# Altium schematic sheet fpga-bank2-inside.SchDoc: FPGA - Bank 2
size Letter; CheckedBy: E. Chiu; CompanyName: Brinton Engineering, LLC; DrawnBy: J. Brinton; Engineer: J. Brinton; Address1: 3479 Edison Way; Address2: Menlo Park CA 94025; Address3: +1 (877) 778-8435; Address4: brintonengineering.com; Revision: 1; SheetNumber: 9; SheetTotal: 60
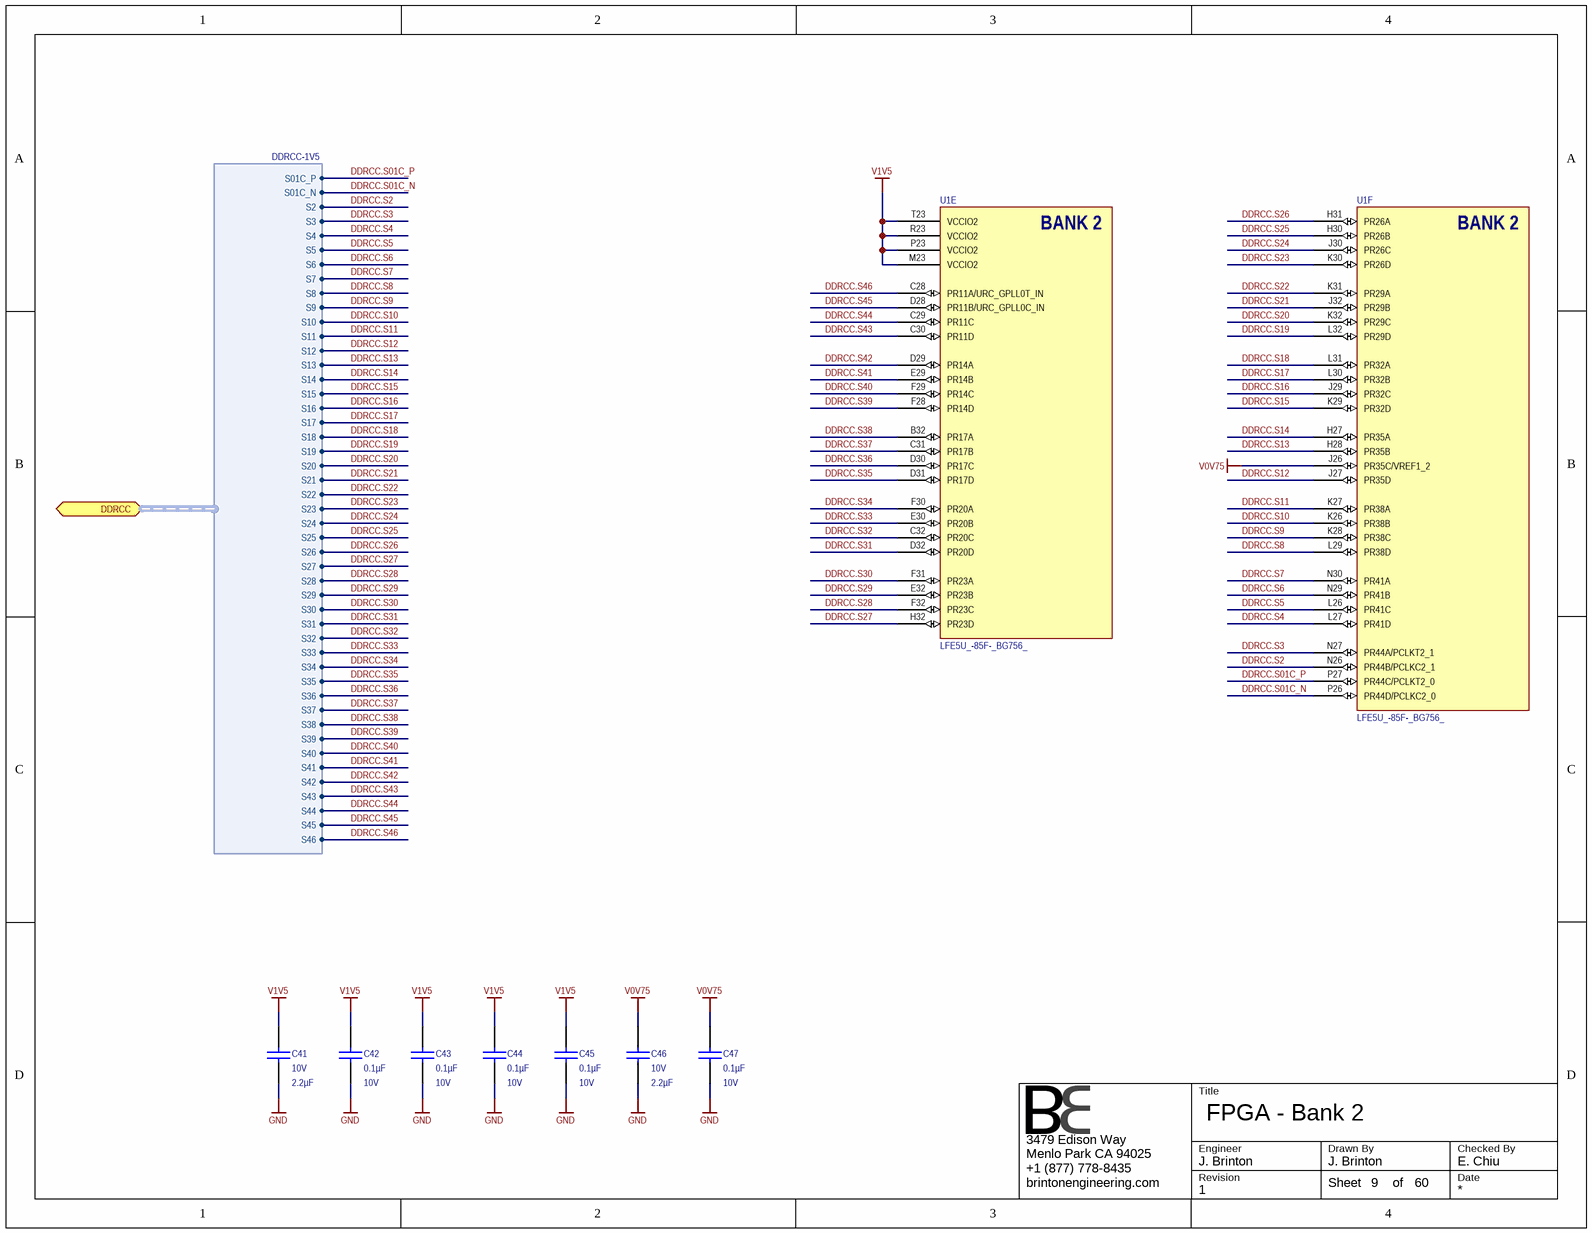
[diagram p0: fpga-bank2-inside.SchDoc]

## Parts
C41  Voltage - Rated: 10V  Capacitance: 2.2µF  [CAPC1608X90N]  (hidden comment: GRM188R71A225KE15D)
C42  Capacitance: 0.1µF  Voltage - Rated: 10V  [CAPC1005X56N]  (hidden comment: GRM155R71A104KA01J)
C43  Capacitance: 0.1µF  Voltage - Rated: 10V  [CAPC1005X56N]  (hidden comment: GRM155R71A104KA01J)
C44  Capacitance: 0.1µF  Voltage - Rated: 10V  [CAPC1005X56N]  (hidden comment: GRM155R71A104KA01J)
C45  Capacitance: 0.1µF  Voltage - Rated: 10V  [CAPC1005X56N]  (hidden comment: GRM155R71A104KA01J)
C46  Voltage - Rated: 10V  Capacitance: 2.2µF  [CAPC1608X90N]  (hidden comment: GRM188R71A225KE15D)
C47  Capacitance: 0.1µF  Voltage - Rated: 10V  [CAPC1005X56N]  (hidden comment: GRM155R71A104KA01J)
U1  LFE5U_-85F-_BG756_  [caBGA756]  (parts E,F of 19)

## Ports
DDRCC (harness DDRCC-1V5)

## Harnesses
DDRCC-1V5: S01C_P, S01C_N, S2, S3, S4, S5, S6, S7, S8, S9, S10, S11, S12, S13, S14, S15, S16, S17, S18, S19, S20, S21, S22, S23, S24, S25, S26, S27, S28, S29, S30, S31, S32, S33, S34, S35, S36, S37, S38, S39, S40, S41, S42, S43, S44, S45, S46

## Nets
GND: C41.1 C42.1 C43.1 C44.1 C45.1 C46.1 C47.1
V0V75: C46.2 C47.2 U1.J26(PR35C/VREF1_2)
V1V5: C41.2 C42.2 C43.2 C44.2 C45.2 U1.M23(VCCIO2) U1.P23(VCCIO2) U1.R23(VCCIO2) U1.T23(VCCIO2)
DDRCC.S01C_N: U1.P26(PR44D/PCLKC2_0) ; port DDRCC.S01C_N
DDRCC.S01C_P: U1.P27(PR44C/PCLKT2_0) ; port DDRCC.S01C_P
DDRCC.S2: U1.N26(PR44B/PCLKC2_1) ; port DDRCC.S2
DDRCC.S3: U1.N27(PR44A/PCLKT2_1) ; port DDRCC.S3
DDRCC.S4: U1.L27(PR41D) ; port DDRCC.S4
DDRCC.S5: U1.L26(PR41C) ; port DDRCC.S5
DDRCC.S6: U1.N29(PR41B) ; port DDRCC.S6
DDRCC.S7: U1.N30(PR41A) ; port DDRCC.S7
DDRCC.S8: U1.L29(PR38D) ; port DDRCC.S8
DDRCC.S9: U1.K28(PR38C) ; port DDRCC.S9
DDRCC.S10: U1.K26(PR38B) ; port DDRCC.S10
DDRCC.S11: U1.K27(PR38A) ; port DDRCC.S11
DDRCC.S12: U1.J27(PR35D) ; port DDRCC.S12
DDRCC.S13: U1.H28(PR35B) ; port DDRCC.S13
DDRCC.S14: U1.H27(PR35A) ; port DDRCC.S14
DDRCC.S15: U1.K29(PR32D) ; port DDRCC.S15
DDRCC.S16: U1.J29(PR32C) ; port DDRCC.S16
DDRCC.S17: U1.L30(PR32B) ; port DDRCC.S17
DDRCC.S18: U1.L31(PR32A) ; port DDRCC.S18
DDRCC.S19: U1.L32(PR29D) ; port DDRCC.S19
DDRCC.S20: U1.K32(PR29C) ; port DDRCC.S20
DDRCC.S21: U1.J32(PR29B) ; port DDRCC.S21
DDRCC.S22: U1.K31(PR29A) ; port DDRCC.S22
DDRCC.S23: U1.K30(PR26D) ; port DDRCC.S23
DDRCC.S24: U1.J30(PR26C) ; port DDRCC.S24
DDRCC.S25: U1.H30(PR26B) ; port DDRCC.S25
DDRCC.S26: U1.H31(PR26A) ; port DDRCC.S26
DDRCC.S27: U1.H32(PR23D) ; port DDRCC.S27
DDRCC.S28: U1.F32(PR23C) ; port DDRCC.S28
DDRCC.S29: U1.E32(PR23B) ; port DDRCC.S29
DDRCC.S30: U1.F31(PR23A) ; port DDRCC.S30
DDRCC.S31: U1.D32(PR20D) ; port DDRCC.S31
DDRCC.S32: U1.C32(PR20C) ; port DDRCC.S32
DDRCC.S33: U1.E30(PR20B) ; port DDRCC.S33
DDRCC.S34: U1.F30(PR20A) ; port DDRCC.S34
DDRCC.S35: U1.D31(PR17D) ; port DDRCC.S35
DDRCC.S36: U1.D30(PR17C) ; port DDRCC.S36
DDRCC.S37: U1.C31(PR17B) ; port DDRCC.S37
DDRCC.S38: U1.B32(PR17A) ; port DDRCC.S38
DDRCC.S39: U1.F28(PR14D) ; port DDRCC.S39
DDRCC.S40: U1.F29(PR14C) ; port DDRCC.S40
DDRCC.S41: U1.E29(PR14B) ; port DDRCC.S41
DDRCC.S42: U1.D29(PR14A) ; port DDRCC.S42
DDRCC.S43: U1.C30(PR11D) ; port DDRCC.S43
DDRCC.S44: U1.C29(PR11C) ; port DDRCC.S44
DDRCC.S45: U1.D28(PR11B/URC_GPLL0C_IN) ; port DDRCC.S45
DDRCC.S46: U1.C28(PR11A/URC_GPLL0T_IN) ; port DDRCC.S46

## Notes on the sheet
- Title
- Engineer
- Revision
- Drawn By
- Checked By
- Date
- Sheet
- of
- (in symbol LFE5U_-85F-_BG756_, part E) BANK 2
- (in symbol LFE5U_-85F-_BG756_, part F) BANK 2

## Library data of the parts
C41 C46 = GRM188R71A225KE15D: CAP CER 2.2UF 10V 10% X7R 0603; Manufacturer: Murata Electronics North America; Manufacturer P/N: GRM188R71A225KE15D; Operating Temperature: -55°C ~ 125°C; Thickness (Max): 0.035" (0.90mm); Tolerance: ±10%; Package / Case: 0603 (1608 Metric); Temperature Coefficient: X7R; Supplier 1: Newark; Supplier 2: Digi-Key; RoHS: RoHS Compliant; Size / Dimension: 0.063" L x 0.031" W (1.60mm x 0.80mm); Mounting Type: Surface Mount, MLCC; ComponentLink1URL: http://www.murata.com/~/media/webrenewal/support/library/catalog/products/capacitor/mlcc/c02e.ashx; ComponentLink1Description: http://www.murata.com/~/media/webrenewal/support/library/catalog/products/capacitor/mlcc/c02e.ashx; Supplier Part Number 1: 72R4209; Supplier Part Number 2: 490-4520-1-ND
C42-C45 C47 = GRM155R71A104KA01J: CAP CER 0.1UF 10V 10% X7R 0402; Manufacturer: Murata Electronics North America; Manufacturer P/N: GRM155R71A104KA01J; Operating Temperature: -55°C ~ 125°C; Thickness (Max): 0.022" (0.55mm); Size / Dimension: 0.039" L x 0.020" W (1.00mm x 0.50mm); RoHS: RoHS Compliant; Mounting Type: Surface Mount, MLCC; Supplier 1: Digi-Key; ComponentLink1URL: http://www.murata.com/~/media/webrenewal/support/library/catalog/products/capacitor/mlcc/c02e.ashx; ComponentLink1Description: http://www.murata.com/~/media/webrenewal/support/library/catalog/products/capacitor/mlcc/c02e.ashx; Supplier Part Number 1: 490-6322-1-ND; Temperature Coefficient: X7R; Package / Case: 0402 (1005 Metric); Tolerance: ±10%
U1 = LFE5U_-85F-_BG756_: ECP5 FPGA, 85k LUT, 756-caBGA; Manufacturer: Lattice Semiconductor; Manufacturer P/N: LFE5U_-85F-_BG756_